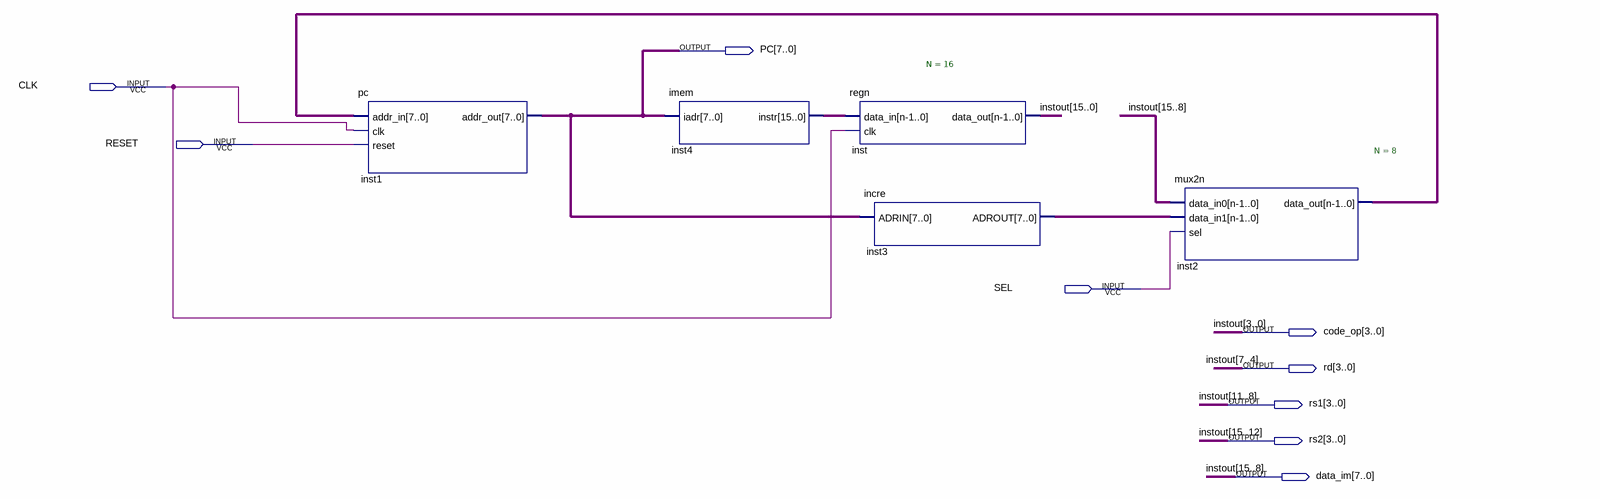
[diagram p0: schematic sheet]
// Quartus schematic ifstage.bdf as structural Verilog: 5 symbols, 9 pins
module ifstage (
  input  CLK,
  input  RESET,
  input  SEL,
  output [7:0] PC,
  output [3:0] code_op,
  output [3:0] rd,
  output [3:0] rs1,
  output [3:0] rs2,
  output [7:0] data_im
);

  wire [7:0] inst2_data_out, inst3_adrout;
  wire [15:0] inst4_instr;

  pc inst1 (.addr_in(inst2_data_out), .clk(CLK), .reset(RESET), .addr_out(PC));
  imem inst4 (.iadr(PC), .instr(inst4_instr));
  regn #(.N(16)) inst (.data_in(inst4_instr), .clk(CLK), .data_out({data_im, rd, code_op}));
  incre inst3 (.ADRIN(PC), .ADROUT(inst3_adrout));
  mux2n #(.N(8)) inst2 (.data_in0(data_im), .data_in1(inst3_adrout), .sel(SEL), .data_out(inst2_data_out));

  assign rs1 = data_im[3:0];
  assign rs2 = data_im[7:4];

  // Other names for the same wires on the sheet: instout[15:0] = {data_im, rd, code_op}
endmodule
